# EAGLE schematic mainboard (EAGLE 7.5.0)
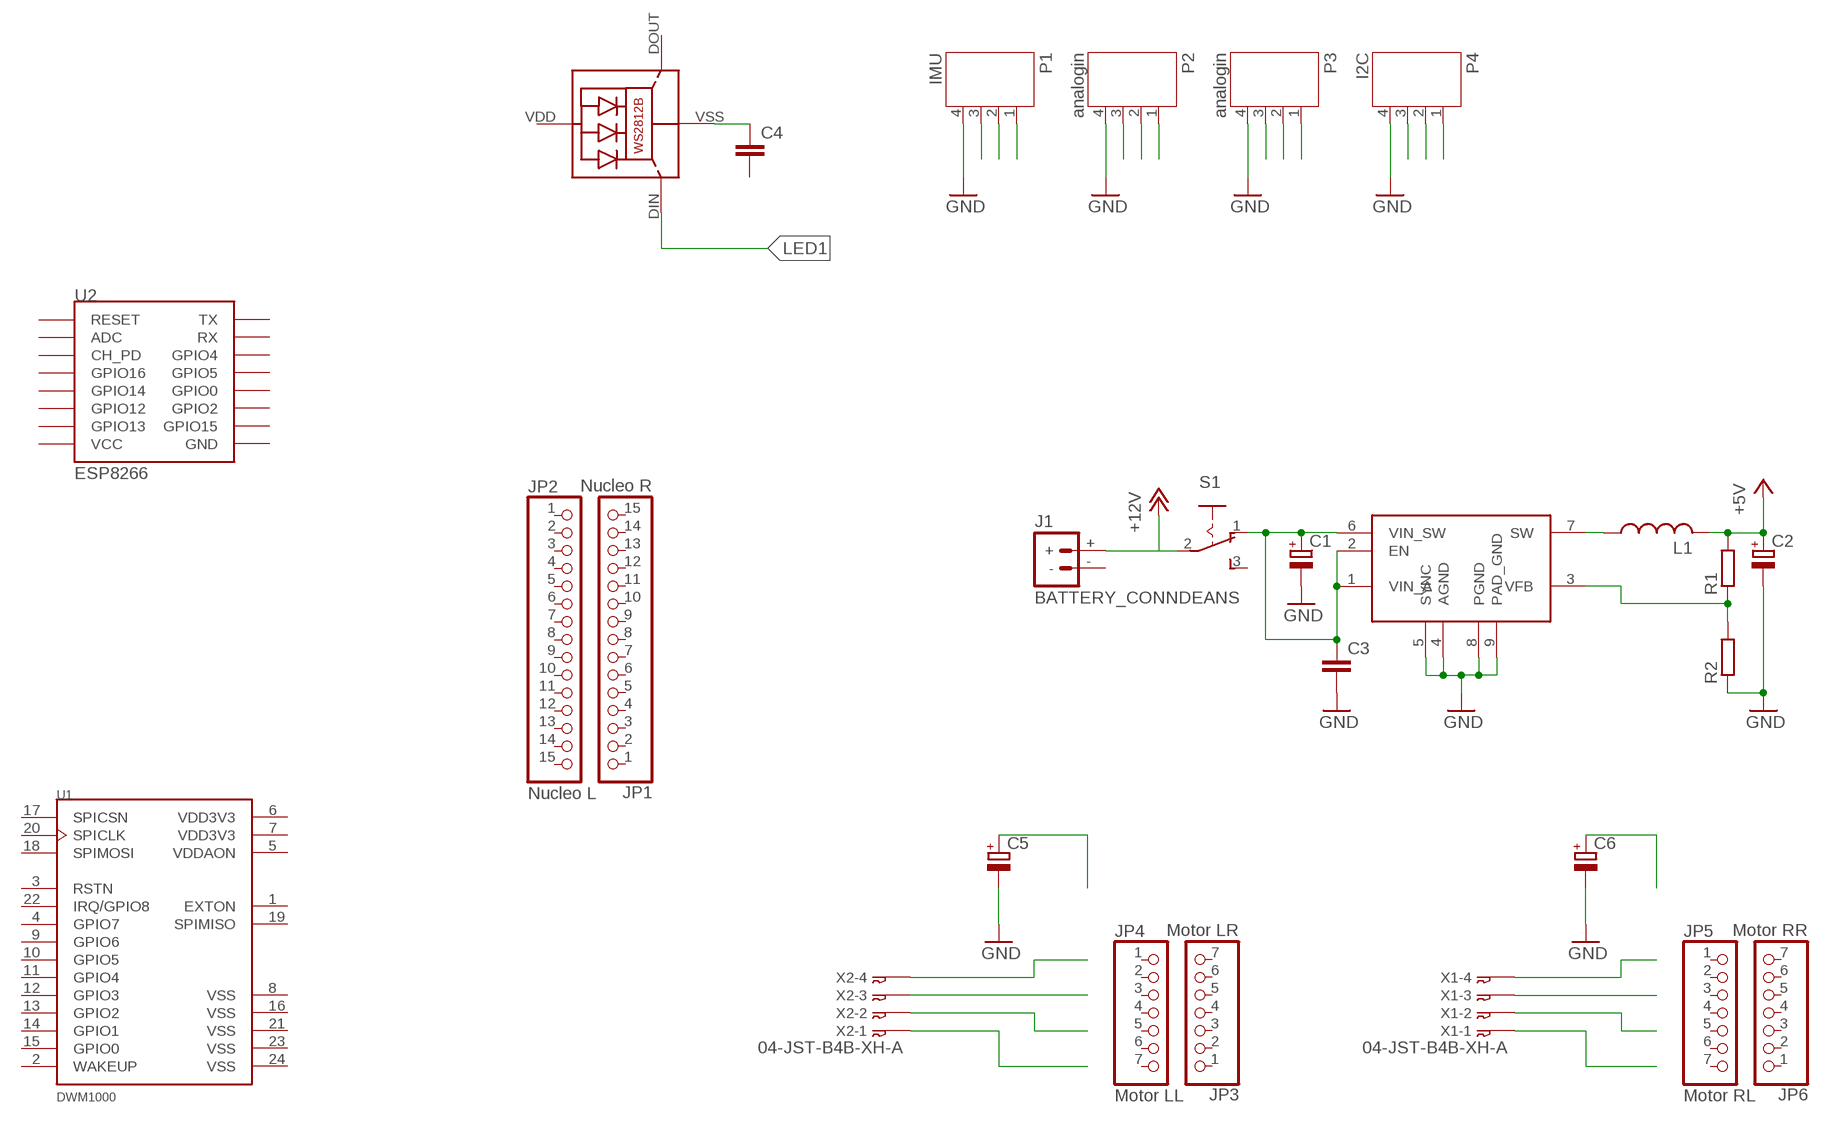
[diagram p0: schematic, sheet 1]

## Parts
C1  CPOL-EU153CLV-0405  [153CLV-0405]
C2  CPOL-EU153CLV-0405  [153CLV-0405]
C3  C-EUC0603K  [C0603K]
C4  C-EUC0603K  [C0603K]
C5  CPOL-EU153CLV-0405  [153CLV-0405]
C6  CPOL-EU153CLV-0405  [153CLV-0405]
J1  BATTERY_CONNDEANS  [DEANS]
JP1  Nucleo R  PINHD-1X15_2.54-SMD  [1X15SMD]
JP2  Nucleo L  PINHD-1X15_2.54-SMD  [1X15SMD]
JP3  Motor LR  PINHD-1X07_2.54-SMD  [1X07SMD]
JP4  Motor LL  PINHD-1X07_2.54-SMD  [1X07SMD]
JP5  Motor RL  PINHD-1X07_2.54-SMD  [1X07SMD]
JP6  Motor RR  PINHD-1X07_2.54-SMD  [1X07SMD]
L1  L-USL4035M  [L4035M]
LED1  WS2812B  [WS2812B]
P1  IMU  JST-PH4  [JST-PH4]
P2  analogin  JST-PH4  [JST-PH4]
P3  analogin  JST-PH4  [JST-PH4]
P4  I2C  JST-PH4  [JST-PH4]
R1  R-EU_R0603  [R0603]
R2  R-EU_R0603  [R0603]
S1  255SB  [255SB]
U1  DWM1000  [XCVR_DWM1000]
U2  ESP8266  ESP12SMD  [ESP12-SMD]
U$1  ST1S10PHR  [HSOP8]
X1  04-JST-B4B-XH-A  [B4B-XH]
X2  04-JST-B4B-XH-A  [B4B-XH]

## Nets
+5V: C2.+ L1.2 R1.2
+12V: J1.+ S1.2(P)
GND: C1.- C2.- C3.2 C5.- C6.- P1.4 P2.4 P3.4 P4.4 R2.1 U$1.4(AGND) U$1.5(SYNC) U$1.8(PGND) U$1.9(PAD_GND)
LED1: LED1.DIN(DI)
N$1: P1.3
N$2: L1.1 U$1.7(SW)
N$3: P1.2
N$4: R1.1 R2.2 U$1.3(VFB)
N$5: C1.+ C3.1 S1.1(O) U$1.1(VIN_A) U$1.2(EN) U$1.6(VIN_SW)
N$6: P1.1
N$7: P2.3
N$8: P2.2
N$9: P2.1
N$10: P3.3
N$11: P3.2
N$12: P3.1
N$13: P4.3
N$14: P4.2
N$15: P4.1
N$16: C4.1 LED1.VSS(GND)
N$17: C5.+
N$18: C6.+
N$19: X2.P$4
N$20: X2.P$3
N$21: X2.P$2
N$22: X2.P$1
N$23: X1.P$4
N$24: X1.P$3
N$25: X1.P$2
N$26: X1.P$1
Unconnected: C4.2 J1.- JP1.1 JP1.2 JP1.3 JP1.4 JP1.5 JP1.6 JP1.7 JP1.8 JP1.9 JP1.10 JP1.11 JP1.12 JP1.13 JP1.14 JP1.15 JP2.1 JP2.2 JP2.3 JP2.4 JP2.5 JP2.6 JP2.7 JP2.8 JP2.9 JP2.10 JP2.11 JP2.12 JP2.13 JP2.14 JP2.15 JP3.1 JP3.2 JP3.3 JP3.4 JP3.5 JP3.6 JP3.7 JP4.1 JP4.2 JP4.3 JP4.4 JP4.5 JP4.6 JP4.7 JP5.1 JP5.2 JP5.3 JP5.4 JP5.5 JP5.6 JP5.7 JP6.1 JP6.2 JP6.3 JP6.4 JP6.5 JP6.6 JP6.7 LED1.DOUT(DO) S1.3(S) U1.1(EXTON) U1.2(WAKEUP) U1.3(RSTN) U1.4(GPIO7) U1.9(GPIO6) U1.10(GPIO5) U1.11(GPIO4) U1.12(GPIO3) U1.13(GPIO2) U1.14(GPIO1) U1.15(GPIO0) U1.17(SPICSN) U1.18(SPIMOSI) U1.19(SPIMISO) U1.20(SPICLK) U1.22(IRQ/GPIO8) U2.ADC U2.CH_PD U2.GND U2.GPIO0 U2.GPIO2 U2.GPIO4 U2.GPIO5 U2.GPIO12 U2.GPIO13 U2.GPIO14 U2.GPIO15 U2.GPIO16 U2.RESET U2.RXD0(RX) U2.TXD0(TX) U2.VCC

## Power pins joined to a net without a drawn wire
VDD: LED1.VDD
VDD3V3: U1.6(VDD3V3) U1.7(VDD3V3)
VDDAON: U1.5(VDDAON)
VSS: U1.8(VSS) U1.16(VSS) U1.21(VSS) U1.23(VSS) U1.24(VSS)

## Library data of the parts
C1 C2 C5 C6 = rcl:CPOL-EU: POLARIZED CAPACITOR, European symbol
C3 C4 = rcl:C-EU: CAPACITOR, European symbol
J1 = SparkFun-Connectors:BATTERY_CONN: Various footprints for battery connectors
JP1 JP2 = pinhead-2:PINHD-1X15: PIN HEADER
JP3-JP6 = pinhead-2:PINHD-1X07: PIN HEADER
L1 = rcl:L-US: INDUCTOR, American symbol
LED1 = WS2812B:WS2812B: Features and Benefits  * Intelligent reverse connect protection, the power supply reverse connection does not damage the IC. * The control circuit and the LED share the only power source. Control circuit and RGB chip are integrated in a package of 5050 components, form a complete control of pixel point.  * Built-in signal reshaping circuit, after wave reshaping to the next driver, ensure wave-form distortion not accumulate.  * Built-in electric reset circuit and power lost reset circuit.  * Each pixel of the three primary color can achieve 256 brightness display, completed 16777216 color full color display, and scan frequency not less than 400Hz/s.  * Cascading port transmission signal by single line.  * Any two point the distance more than 5m transmission signal without any increase circuit.  * When the refresh rate is 30fps, cascade number are not less than1024 points.  * Send data at speeds of 800Kbps.  *The color of the light were highly consistent, cost-effective. Applications  Full-color module, Full color soft lights a lamp strip. LED decorative lighting, Indoor/outdoor LED video irregular screen. General description WS2812B is a intelligent control LED light source that the control circuit and RGB chip are integrated in a package of 5050 components. It internal include intelligent digital port data latch and signal reshaping amplification drive circuit. Also include a precision internal oscillator and a 12V voltage programmable constant curre-nt control part, effectively ensuring the pixel point light color height consistent. The data transfer protocol use single NZR communication mode. After the pixel power-on reset, the DIN port receive data from controller, the first pixel collect initial 24bit data then sent to the internal data latch, the other data which reshaping by the internal signal reshaping amplification circuit sent to the next cascade pixel through the DO port. After transmission for each pixel,the signal to reduce 24bit. pixel adopt auto reshaping transmit technology, making the pixel cascade number is not limited the signal transmission, only depend on the speed of signal transmission. LED with low driving voltage, environmental protection and energy saving, high brightness, scattering angle is large, good consistency, low power, long life and other advantages. The control chip integrated in LED above becoming more simple circuit, small volume, convenient installation. Absolute Maximum Ratings Power supply voltage: VDD +3.5V..+5.3V Input voltage: VI -0.5V..VDD+0.5V based on WS2812 from https://github.com/adafruit/Adafruit-Eagle-Library
P1-P4 = jst-ph:JST-PH4
R1 R2 = rcl:R-EU_: RESISTOR, European symbol
S1 = switch:255SB: SLIDING SWITCH Distributor Buerklin, 11G810
U1 = DWM1000:DWM1000: Mod Ieee802.15.4-2011 Uwb Txrx
U2 = esp8266modules:ESP12: ESP8266 Wifi module 12
U$1 = ST1S10PHR:ST1S10PHR: mada by Sabre
X1 X2 = bt_con-jst-xh:04-JST: JST CONNECTOR